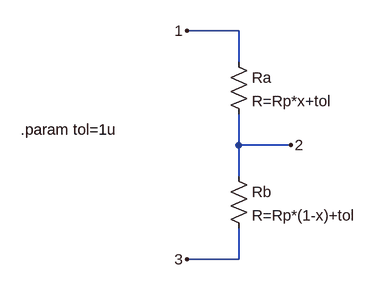
[diagram p0: schematic LinearPotentiometer.asc]
LinearPotentiometer.asc, the LTspice schematic file:
Version 4
SHEET 1 880 680
WIRE 208 0 128 0
WIRE 208 48 208 0
WIRE 208 176 208 128
WIRE 288 176 208 176
WIRE 208 224 208 176
WIRE 208 352 208 304
WIRE 208 352 128 352
FLAG 128 0 1
FLAG 128 352 3
FLAG 288 176 2
SYMBOL res 192 32 R0
SYMATTR InstName Ra
SYMATTR Value R=Rp*x+tol
SYMBOL res 192 208 R0
SYMATTR InstName Rb
SYMATTR Value R=Rp*(1-x)+tol
TEXT -128 152 Left 2 !.param tol=1u

The netlist it stands for:
* LinearPotentiometer.asc
Ra 1 2 R=Rp*x+tol
Rb 2 3 R=Rp*(1-x)+tol
.param tol=1u
.backanno
.end